# EAGLE design Pi_grammer_SPEEDY_SPI_V2 (EAGLE 7.6.0)
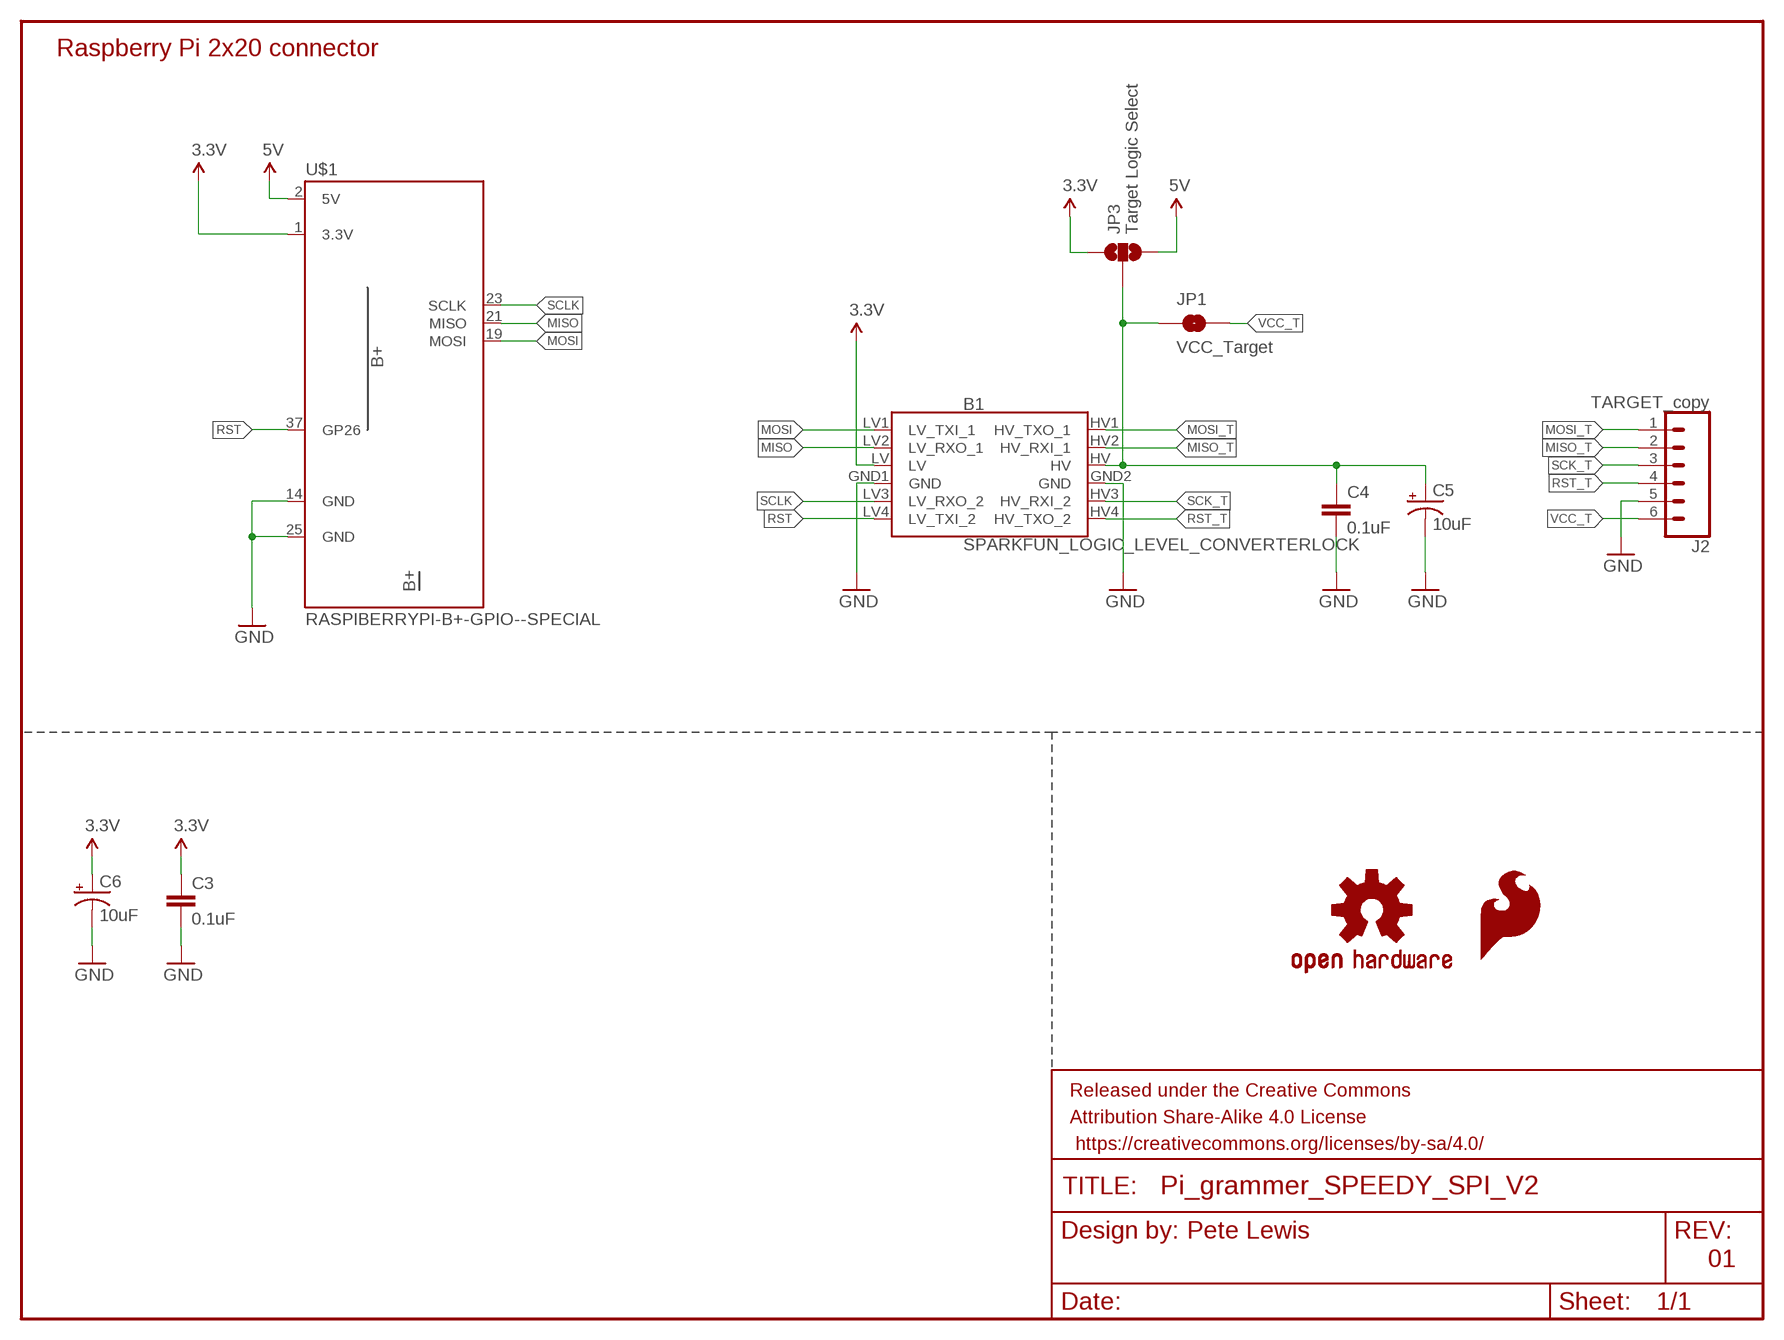
[diagram p0: schematic, sheet 1]

## Parts
B1  SPARKFUN_LOGIC_LEVEL_CONVERTERLOCK  [SPARKFUN_LOGIC_LEVEL_CONVERTER_LOCK]
C3  0.1uF  0.1UF-0603-25V-(+80/-20%)  [0603]
C4  0.1uF  0.1UF-0603-25V-(+80/-20%)  [0603]
C5  10uF  10UF-POLAR-EIA3216-16V-10%(TANT)  [EIA3216]
C6  10uF  10UF-POLAR-EIA3216-16V-10%(TANT)  [EIA3216]
FRAME1  FRAME-LETTER  [CREATIVE_COMMONS]
J2  TARGET_copy  CONN_06SIP_LOCK  [1X06-SIP_LOCK]
JP1  VCC_Target  JUMPER-SMT_2_NO_SILK  [SMT-JUMPER_2_NO_SILK]
JP3  Target Logic Select  JUMPER-SMT_3_NO_SILK  [SMT-JUMPER_3_NO_SILK]
LOGO1  SFE_LOGO_FLAME.1_INCH  [SFE_LOGO_FLAME_.1]
LOGO2  OSHW-LOGOS  [OSHW-LOGO-S]
U$1  RASPIBERRYPI-B+-GPIO--SPECIAL  [2X20-SHROUDED--SPECIAL]

## Nets
3.3V: B1.LV C3.1 C6.+ JP3.1 U$1.1(3.3V)
5V: JP3.3 U$1.2(5V)
GND: B1.GND1(GND) B1.GND2(GND) C3.2 C4.2 C5.- C6.- J2.5 U$1.14(GND) U$1.25(GND)
MISO: B1.LV2(LV_RXO_1) U$1.21(MISO)
MISO_T: B1.HV2(HV_RXI_1) J2.2
MOSI: B1.LV1(LV_TXI_1) U$1.19(MOSI)
MOSI_T: B1.HV1(HV_TXO_1) J2.1
N$4: B1.HV C4.1 C5.+ JP1.1 JP3.2
RST: B1.LV4(LV_TXI_2) U$1.37(GP26)
RST_T: B1.HV4(HV_TXO_2) J2.4
SCK_T: B1.HV3(HV_RXI_2) J2.3
SCLK: B1.LV3(LV_RXO_2) U$1.23(SCLK)
VCC_T: J2.6 JP1.2

## Notes on the sheet
- Raspberry Pi 2x20 connector
- Pete Lewis
- 01

## Library data of the parts
B1 = SparkFun-Boards:SPARKFUN_LOGIC_LEVEL_CONVERTER: SparkFun Logic Level Converter -Bi-Directional This is the mechnical outline for the 3.3V - 5V bi directional logic level converter. *Note, the "LOCK" Package has the header pins staggered by an offset of 5 mils (off center line), so that when you slide a row of standard 0.1" headers into the PTH pads, it will hold position vertically. See the follwing turorial for more information on this type of special footprints: Sneaky Footprints <https://www.sparkfun.com/tutorials/114> SparkFun Products: SparkFun Logic Level Converter - Bi-Directional <https://www.sparkfun.com/products/12009>
C3 C4 = SparkFun-Capacitors:0.1UF: 0.1µF ceramic capacitors A capacitor is a passive two-terminal electrical component used to store electrical energy temporarily in an electric field.; PROD_ID: CAP-00810
C5 C6 = SparkFun-Capacitors:10UF-POLAR: 10.0µF polarized capacitors A capacitor is a passive two-terminal electrical component used to store electrical energy temporarily in an electric field.; PROD_ID: CAP-00811
FRAME1 = SparkFun-Aesthetics:FRAME-LETTER: Schematic Frame - Letter Standard 8.5x11 US Letter frame
J2 = SparkFun-Connectors:CONN_06: Header 6 Standard 6-pin 0.1" header. Use with straight break away headers (SKU : PRT-00116), right angle break away headers (PRT-00553), swiss pins (PRT-00743), machine pins (PRT-00117), and female headers (PRT-00115). Molex polarized connector foot print use with SKU : PRT-08094 with associated crimp pins and housings. NOTES ON THE VARIANTS LOCK and LOCK_LONGPADS... This footprint was designed to help hold the alignment of a through-hole component (i.e. 6-pin header) while soldering it into place. You may notice that each hole has been shifted either up or down by 0.005 of an inch from it's more standard position (which is a perfectly straight line). This slight alteration caused the pins (the squares in the middle) to touch the edges of the holes. Because they are alternating, it causes a "brace" to hold the component in place. 0.005 has proven to be the perfect amount of "off-center" position when using our standard breakaway headers. Although looks a little odd when you look at the bare footprint, once you have a header in there, the alteration is very hard to notice. Also,if you push a header all the way into place, it is covered up entirely on the bottom side. This idea of altering the position of holes to aid alignment will be further integrated into the Sparkfun Library for other footprints. It can help hold any component with 3 or more connection pins.; PROD_ID: CONN-09698
JP1 = SparkFun-Jumpers:JUMPER-SMT_2_NO: Normally open jumper This jumper has two pads in close proximity to each other. Apply solder to close the connection. Round pads are easier to solder for beginners, but are a lot larger. SparkFun Product that uses the round pads: SparkFun EL Sequencer <https://www.sparkfun.com/products/12781>
JP3 = SparkFun-Jumpers:JUMPER-SMT_3_NO: Normally open jumper This jumper has three pads in close proximity to each other. Apply solder to close the connection(s).
LOGO1 = SparkFun-Aesthetics:SFE_LOGO_FLAME: SFE Logo, flame only This is the SparkFun flame logo. The logo on the schematic will always be the same size; the package variant is the height of the flame. Default layer for the logo on the board is tSilk.
LOGO2 = SparkFun-Aesthetics:OSHW-LOGO: Open Source Hardware Logo This logo indicates the piece of hardware it is found on incorporates a OSHW license and/or adheres to the definition of open source hardware found here: http://freedomdefined.org/OSHW
U$1 = SparkFun-Boards:RASPIBERRYPI-B+-GPIO--SPECIAL

## Board
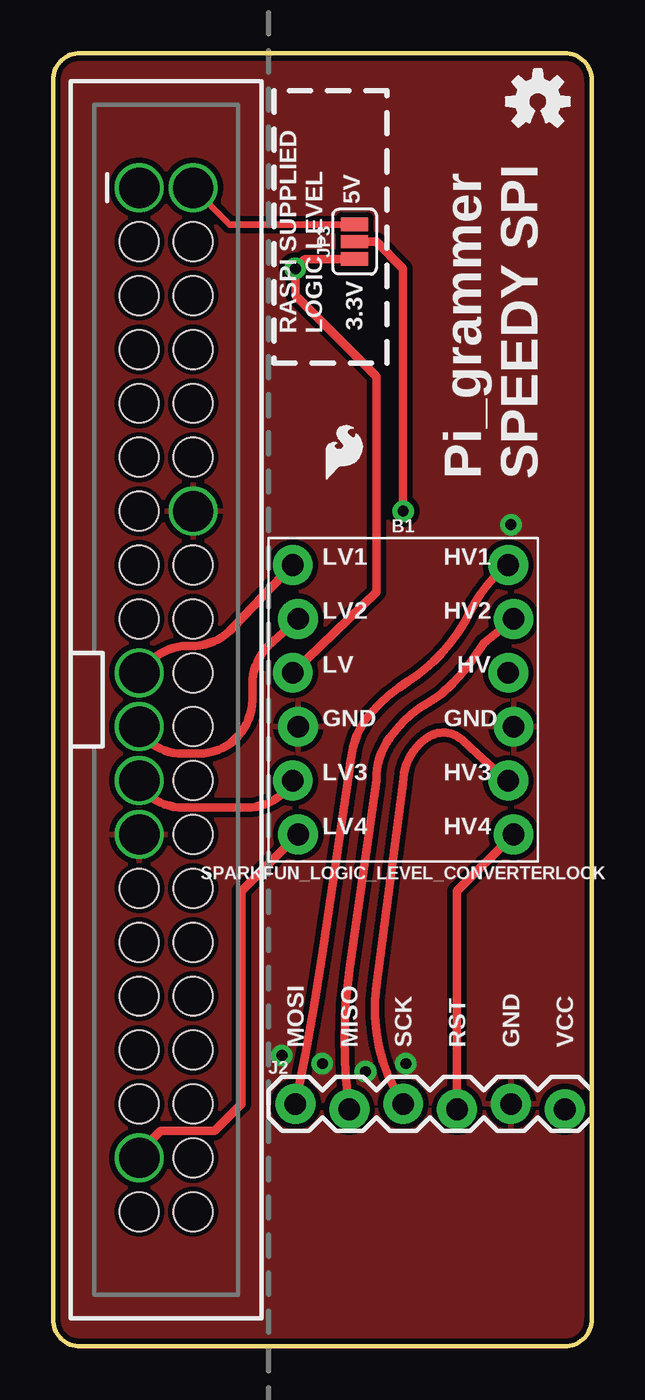
[diagram p1: board, top side]
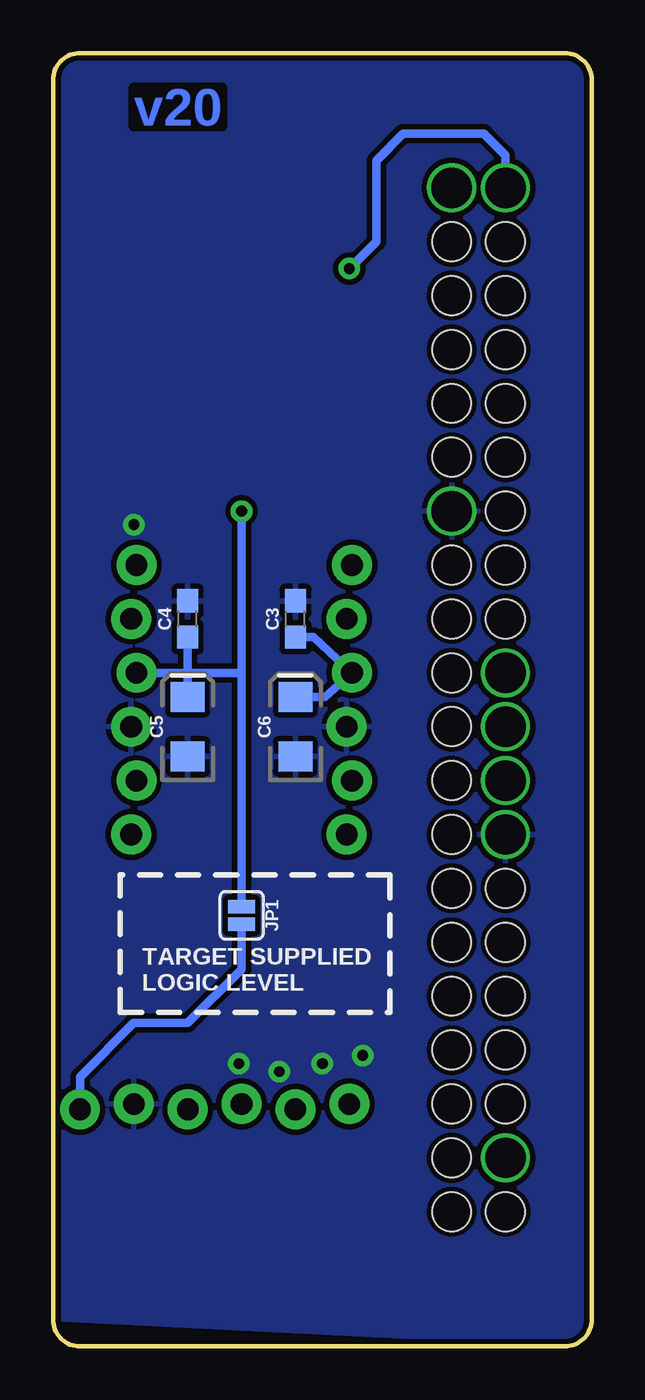
[diagram p2: board, bottom side, seen from below]

Size 25.4 x 60.96 mm. Coordinates in mm from the lower left corner, seen from the top.
Outline: 25.4,59.69 25.4,1.27 arc-90 24.13,0 1.27,0 arc-90 0,1.27 0,59.69 arc-90 1.27,60.96 24.13,60.96 arc-90 25.4,59.69
Copper layers (1*16): Top 0.035mm / dielectric 1.5mm / Bottom 0.035mm
Design rules "SparkFun-2-layer-STANDARD *": minimum track width 10mil, minimum drill 20mil, track to track 10mil, track to pad 8mil, pad to pad 8mil, via to via 10mil, smd to smd 8mil, copper to edge 8mil, drill to drill 8mil, minimum pad ring 8mil, minimum via ring 10mil, stop-mask expansion 4mil, vias tented up to drill 25mil, thermal gap 10mil

### Footprints (pad centres in the part's own frame; a part is rotated, then mirrored left to right if it is on the bottom)
SPARKFUN_LOGIC_LEVEL_CONVERTER_LOCK = drill 1.016 pad 1.88: GND1 -4.953,-1.27; GND2 5.207,-1.27; HV 4.953,1.27; HV1 4.953,6.35; HV2 5.207,3.81; HV3 4.953,-3.81; HV4 5.207,-6.35; LV -5.207,1.27; LV1 -5.207,6.35; LV2 -4.953,3.81; LV3 -5.207,-3.81; LV4 -4.953,-6.35
0603 = smd 1.1 x 1: 1 -0.85,0; 2 0.85,0
EIA3216 = smd 1.4 x 1.6: + 1.4,0; - -1.4,0
1X06-SIP_LOCK = drill 1.016 pad 1.88: 1 0,0; 2 2.54,-0.254; 3 5.08,0; 4 7.62,-0.254; 5 10.16,0; 6 12.7,-0.254
SMT-JUMPER_2_NO_SILK = smd 0.635 x 1.27: 1 -0.406,0; 2 0.406,0
SMT-JUMPER_3_NO_SILK = smd 0.635 x 1.27: 1 -0.813,0; 2 0,0; 3 0.813,0
2X20-SHROUDED--SPECIAL = drill 1.905 pad 2.286: 1 -1.27,24.13; 2 1.27,24.13; 14 1.27,8.89; 19 -1.27,1.27; 21 -1.27,-1.27; 23 -1.27,-3.81; 25 -1.27,-6.35; 37 -1.27,-21.59 | hole 1.829: -1.27,21.59; -1.27,19.05; -1.27,16.51; 1.27,16.51; 1.27,13.97; 1.27,11.43; -1.27,11.43; -1.27,8.89; -1.27,6.35; 1.27,6.35; 1.27,3.81; 1.27,1.27; 1.27,-1.27; 1.27,-3.81; 1.27,-6.35; 1.27,-8.89; -1.27,-8.89; -1.27,-11.43; -1.27,-13.97; 1.27,-13.97; -1.27,-16.51; 1.27,-19.05; 1.27,-21.59; 1.27,-24.13; -1.27,-19.05; -1.27,-24.13; 1.27,-16.51; 1.27,-11.43; -1.27,13.97; 1.27,19.05; 1.27,21.59; -1.27,3.81

### Placement (x,y rotation side)
B1  16.51,30.48 0 top
C3  13.97,34.29 90 bottom
C4  19.05,34.29 90 bottom
C5  19.05,29.21 90 bottom
C6  13.97,29.21 90 bottom
FRAME1  -22.86,-36.83 0 top  (outside the outline)
J2  11.43,11.43 0 top
JP1  16.51,20.32 270 bottom
JP3  14.22,52.07 90 top
LOGO1  12.57,40.51 0 top
LOGO2  22.86,58.67 0 top
U$1  5.33,30.48 0 top

### Tracks (layer width: path | path; a pad name or v marks a point on that pad's centre or on a via)
3.3V  (via drill 0.51 pad 1.02)
  Top 0.406: JP3.1 11.89,51.26 v11.43,50.8 11.43,49.53 15.24,45.72 15.24,35.56 B1.LV
  Bottom 0.406: U$1.1 4.06,56.13 5.08,57.15 8.89,57.15 10.16,55.88 10.16,52.07 v11.43,50.8 | C6.+ 12.57,30.61 B1.LV 13.12,33.44 C3.1
5V
  Top 0.305: JP3.3 8.33,52.88 U$1.2
GND  (via drill 0.51 pad 1.02)
  other vias: 21.59,38.73 12.7,13.33 14.73,12.95 16.64,13.33 10.79,13.72
  pour Bottom (isolate 0.254): 0,60.96 25.4,62.23 25.4,1.27 0,0
  pour Top (isolate 0.254): 0,60.96 0,1.27 arc90 1.27,0 25.4,0 25.4,59.69 arc90 21.59,60.96
MISO
  Top 0.406: U$1.21 4.06,28.96 4.34,28.68 arc45 6.13,27.94 6.86,27.94 arc90 9.4,30.48 9.4,31.21 arc-45 10.14,33 B1.LV2
MISO_T
  Top 0.406: B1.HV2 20.32,33.15 arc-17 18.29,30.73 arc-6 17.27,30.1 arc16 15.88,28.7 arc37 15.24,26.67 13.97,17.78 arc16 J2.2
MOSI
  Top 0.406: U$1.19 4.72,32.4 arc-45 6.51,33.02 6.7,33.02 arc45 8.49,33.89 B1.LV1
MOSI_T
  Top 0.406: B1.HV1 arc27 19.69,34.67 arc-16 18.29,32.64 arc-15 16.76,31.37 arc17 14.99,29.84 arc35 14.1,27.94 arc6 13.97,27.18 12.7,18.54 arc-4 J2.1
N$4  (via drill 0.51 pad 1.02)
  Top 0.406: JP3.2 15.24,52.07 16.51,50.8 v16.51,39.37
  Bottom 0.406: 19.05,31.75 B1.HV | C5.+ 19.05,31.75 | C4.1 19.05,31.75 | JP1.1 16.51,31.75 | 16.51,31.75 v16.51,39.37 | 19.05,31.75 16.51,31.75
RST
  Top 0.406: U$1.37 4.06,9.14 5.08,10.16 7.62,10.16 8.89,11.43 8.89,21.46 B1.LV4
RST_T
  Top 0.406: J2.4 19.05,21.46 B1.HV4
SCK_T
  Top 0.406: B1.HV3 arc-6 19.3,28.57 arc77 17.65,28.7 arc56 16.51,26.54 15.24,17.02 arc41 J2.3
SCLK
  Top 0.406: U$1.23 4.06,26.42 4.34,26.14 arc45 6.13,25.4 9.11,25.4 arc45 10.9,26.14 B1.LV3
VCC_T
  Bottom 0.406: J2.6 24.13,12.7 21.59,15.24 19.05,15.24 16.51,17.78 JP1.2

### Text on the board
Bottom: v20
tPlace: 5V | RASPI SUPPLIED / LOGIC LEVEL | 3.3V | Pi_grammer / SPEEDY SPI | MOSI | MISO | SCK | RST | GND | VCC
bPlace: TARGET SUPPLIED / LOGIC LEVEL
Reference: HARDWARE # | Pi_grammer | RASPI / AVR / PROGRAMMER | POWER | STAT | SUCCESS | FAIL | FUSE BITS | FLASH HEX | LOCK BITS | GP20 | SERIAL UPLOAD | GND | GP21 | AT42QT1010 | 0.1uF | MOSI | 10K | 10nF | TAP | 1K | MISO | TO | SCK | RST | PROGRAM | GND | SHUTDOWN / RASPI | NC
tDocu: EDGE of raspi enclosure | Pete Lewis